# Altium schematic sheet Ext_Components.SchDoc
size A; SheetNumber: 7; SheetTotal: 7
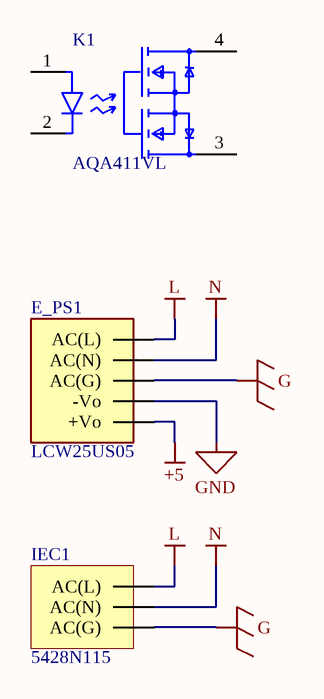
[diagram p0: Ext_Components.SchDoc]

## Parts
E_PS1  LCW25US05  [LCW25US12-Footprint-1]  (mechanical)
IEC1  5428N115  [5428N115-Footprint-1]  (mechanical)
K1  AQA411VL  [AQA411VL-Footprint-1]

## Nets
+5: E_PS1.4(+Vo)
G: E_PS1.2(AC(G)) IEC1.2(AC(G))
GND: E_PS1.3(-Vo)
L: E_PS1.0(AC(L)) IEC1.0(AC(L))
N: E_PS1.1(AC(N)) IEC1.1(AC(N))

Not connected (* = marked no-connect by the designer): K1 1(A) 2(C) 3(1_DRAIN) 4(2_DRAIN)

## Library data of the parts
E_PS1 = CMP-019-00070-2: Power Supply, AC-DC, Enclosed, Industrial, 25W, 5V, LCW25 Series
IEC1 = CMP-002-00128-4: IEC Connector with Power Switch Screw on, C20, 20A UL, DPST-NO; Voltage Rating: 250V; Connector Type: C20; Max Current Rating: 20A; Pins: 3; ComponentLink1Description: Part Link; ComponentLink1URL: https://www.mcmaster.com/5428N115/
K1 = CMP-00026-00010-1: Relay Ssr 50MA 1.5V Dc-in 0.25A 40V Ac/dc-out 4-PIN SSOP T/r; Input Type: DC; Max Power Dissipation: 300mW; On-State Resistance: 1.25R; Isolation Voltage-Max: 1.5kV; Load Current: 250mA; Forward Current: 900uA; Throw Configuration: SPST; Lead Free: Lead Free; Max Operating Temperature: 85°C; Number of Pins: 4; Max Input Voltage: 1.5V; Max Input Current: 50mA; Series: PhotoMOS™ AQY; Output Voltage: 40V; Isolation Voltage: 1.5kV; Height: 1.8mm; Width: 2.65mm; Radiation Hardening: No; Packaging: Tape and Reel; Length: 4.45mm; Max Output Voltage: 40V; Mount: Surface Mount; Relay Type: Relay; RoHS Compliant: Yes; On-state Resistance-Max: 1.25R; Min Operating Temperature: -40°C; Output Current: 250mA; Input Current: 50mA; Case/Package: SSOP; Package Quantity: 1; Reach SVHC Compliant: Yes; Max Output Current: 250mA; Termination: SMD/SMT